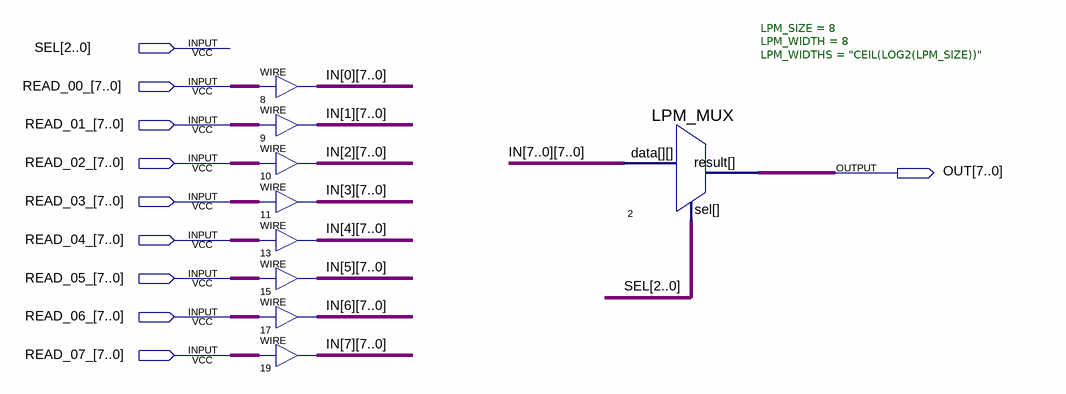
[diagram p0: schematic sheet]
// Quartus schematic mux8.bdf as structural Verilog: 9 symbols, 10 pins
module mux8 (
  input  [2:0] SEL,
  input  [7:0] READ_00_,
  input  [7:0] READ_01_,
  input  [7:0] READ_02_,
  input  [7:0] READ_03_,
  input  [7:0] READ_04_,
  input  [7:0] READ_05_,
  input  [7:0] READ_06_,
  input  [7:0] READ_07_,
  output [7:0] OUT
);

  wire [7:0] IN_0, IN_1, IN_2, IN_3, IN_4, IN_5, IN_6, IN_7;

  assign IN_0 = READ_00_;  // WIRE 8
  assign IN_1 = READ_01_;  // WIRE 9
  assign IN_2 = READ_02_;  // WIRE 10
  assign IN_3 = READ_03_;  // WIRE 11
  assign IN_4 = READ_04_;  // WIRE 13
  assign IN_5 = READ_05_;  // WIRE 15
  assign IN_6 = READ_06_;  // WIRE 17
  assign IN_7 = READ_07_;  // WIRE 19
  LPM_MUX #(.LPM_SIZE(8), .LPM_WIDTH(8), .LPM_WIDTHS("CEIL(LOG2(LPM_SIZE))")) u_2 (
    .data({IN_7, IN_6, IN_5, IN_4, IN_3, IN_2, IN_1, IN_0}), .sel(SEL), .result(OUT));
endmodule
